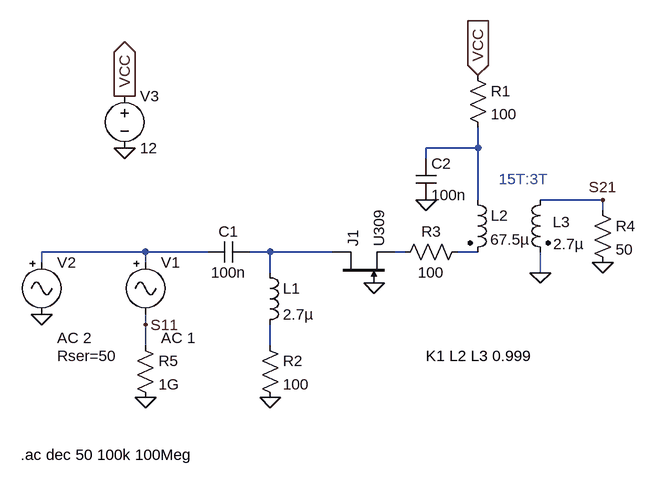
[diagram p0: schematic RF Preamp.asc]
RF Preamp.asc, the LTspice schematic file:
Version 4
SHEET 1 880 680
WIRE 304 32 304 0
WIRE 304 32 224 32
WIRE 224 48 224 32
WIRE 304 112 304 32
WIRE 496 112 400 112
WIRE 496 128 496 112
WIRE -208 192 -368 192
WIRE -112 192 -208 192
WIRE -16 192 -48 192
WIRE 80 192 -16 192
WIRE 192 192 176 192
WIRE 304 192 272 192
WIRE -368 208 -368 192
WIRE -208 208 -208 192
WIRE -16 224 -16 192
WIRE 400 224 400 192
WIRE -208 304 -208 288
WIRE -208 336 -208 304
WIRE -16 336 -16 304
FLAG -16 416 0
FLAG 496 208 0
FLAG 144 240 0
FLAG -368 288 0
FLAG -208 416 0
FLAG -240 32 0
FLAG -240 -48 VCC
IOPIN -240 -48 Out
FLAG 304 -80 VCC
IOPIN 304 -80 In
FLAG 224 112 0
FLAG 400 224 0
FLAG -208 304 S11
FLAG 496 112 S21
SYMBOL njf 80 240 R270
SYMATTR InstName J1
SYMATTR Value U309
SYMBOL ind -32 208 R0
SYMATTR InstName L1
SYMATTR Value 2.7µ
SYMBOL ind2 288 96 R0
WINDOW 3 35 77 Left 0
SYMATTR Value 67.5µ
SYMATTR InstName L2
SYMATTR Type ind
SYMBOL ind2 416 96 M0
WINDOW 0 -30 50 Left 0
WINDOW 3 -51 84 Left 0
SYMATTR InstName L3
SYMATTR Value 2.7µ
SYMATTR Type ind
SYMBOL res 288 -96 R0
SYMATTR InstName R1
SYMATTR Value 100
SYMBOL res -32 320 R0
SYMATTR InstName R2
SYMATTR Value 100
SYMBOL res 288 176 R90
WINDOW 0 0 56 VBottom 0
WINDOW 3 32 56 VTop 0
SYMATTR InstName R3
SYMATTR Value 100
SYMBOL cap -48 176 R90
WINDOW 0 0 32 VBottom 0
WINDOW 3 32 32 VTop 0
SYMATTR InstName C1
SYMATTR Value 100n
SYMBOL res 480 112 R0
SYMATTR InstName R4
SYMATTR Value 50
SYMBOL Misc\\signal -208 192 R0
WINDOW 123 24 132 Left 0
WINDOW 39 0 0 Left 0
SYMATTR Value2 AC 1
SYMATTR InstName V1
SYMATTR Value ""
SYMBOL Misc\\signal -368 192 R0
WINDOW 123 24 132 Left 0
WINDOW 39 24 160 Left 0
SYMATTR Value2 AC 2
SYMATTR SpiceLine Rser=50
SYMATTR InstName V2
SYMATTR Value ""
SYMBOL res -224 320 R0
SYMATTR InstName R5
SYMATTR Value 1G
SYMBOL cap 208 48 R0
SYMATTR InstName C2
SYMATTR Value 100n
SYMBOL voltage -240 -64 R0
WINDOW 123 0 0 Left 0
WINDOW 39 0 0 Left 0
SYMATTR InstName V3
SYMATTR Value 12
TEXT 224 352 Left 0 !K1 L2 L3 0.999
TEXT -400 504 Left 0 !.ac dec 50 100k 100Meg
TEXT 336 80 Left 0 ;15T:3T

The netlist it stands for:
* RF Preamp.asc
J1 N003 0 N004 U309
L1 N003 N006 2.7µ
L2 N001 N005 67.5µ
L3 S21 0 2.7µ
R1 VCC N001 100
R2 N006 0 100
R3 N005 N004 100
C1 N003 N002 100n
R4 S21 0 50
V1 N002 S11 AC 1
V2 N002 0 AC 2 Rser=50
R5 S11 0 1G
C2 N001 0 100n
V3 VCC 0 12
.model NJF NJF
.model PJF PJF
.lib standard.jft
K1 L2 L3 0.999
.ac dec 50 100k 100Meg
* 15T:3T
.backanno
.end

* Results of the author's LTspice run, read from the files saved beside the schematic
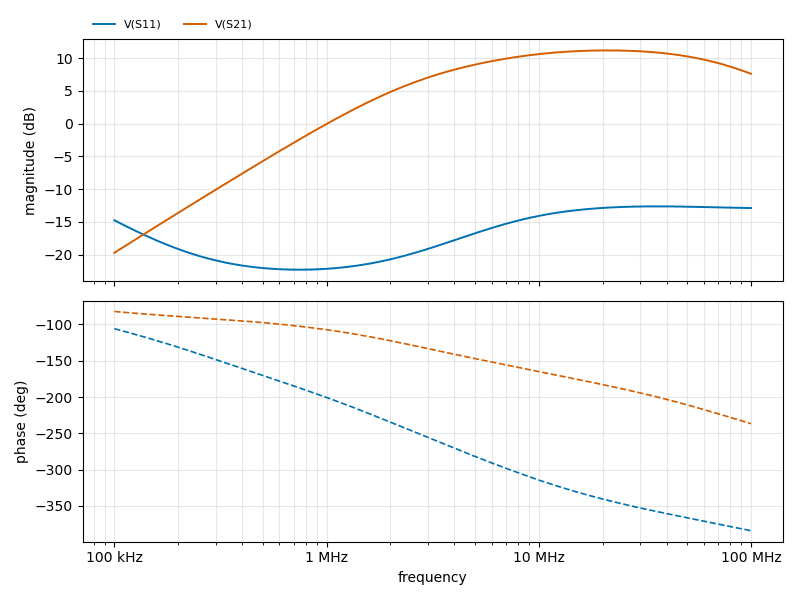
[diagram p1: AC Analysis of RF Preamp.asc, plotted from the saved traces]
* AC Analysis, 1 run:
*   V(S11): -14.74 dB at 100 kHz, -12.87 dB at 100 MHz, peak -12.62 dB at 36.31 MHz, 3 dB below the peak at 6.424 MHz
*   V(S21): -19.70 dB at 100 kHz, 7.61 dB at 100 MHz, peak 11.18 dB at 20.89 MHz, 3 dB below the peak at 3.926 MHz and 89.69 MHz